# EAGLE design fanController (EAGLE 7.0.0)
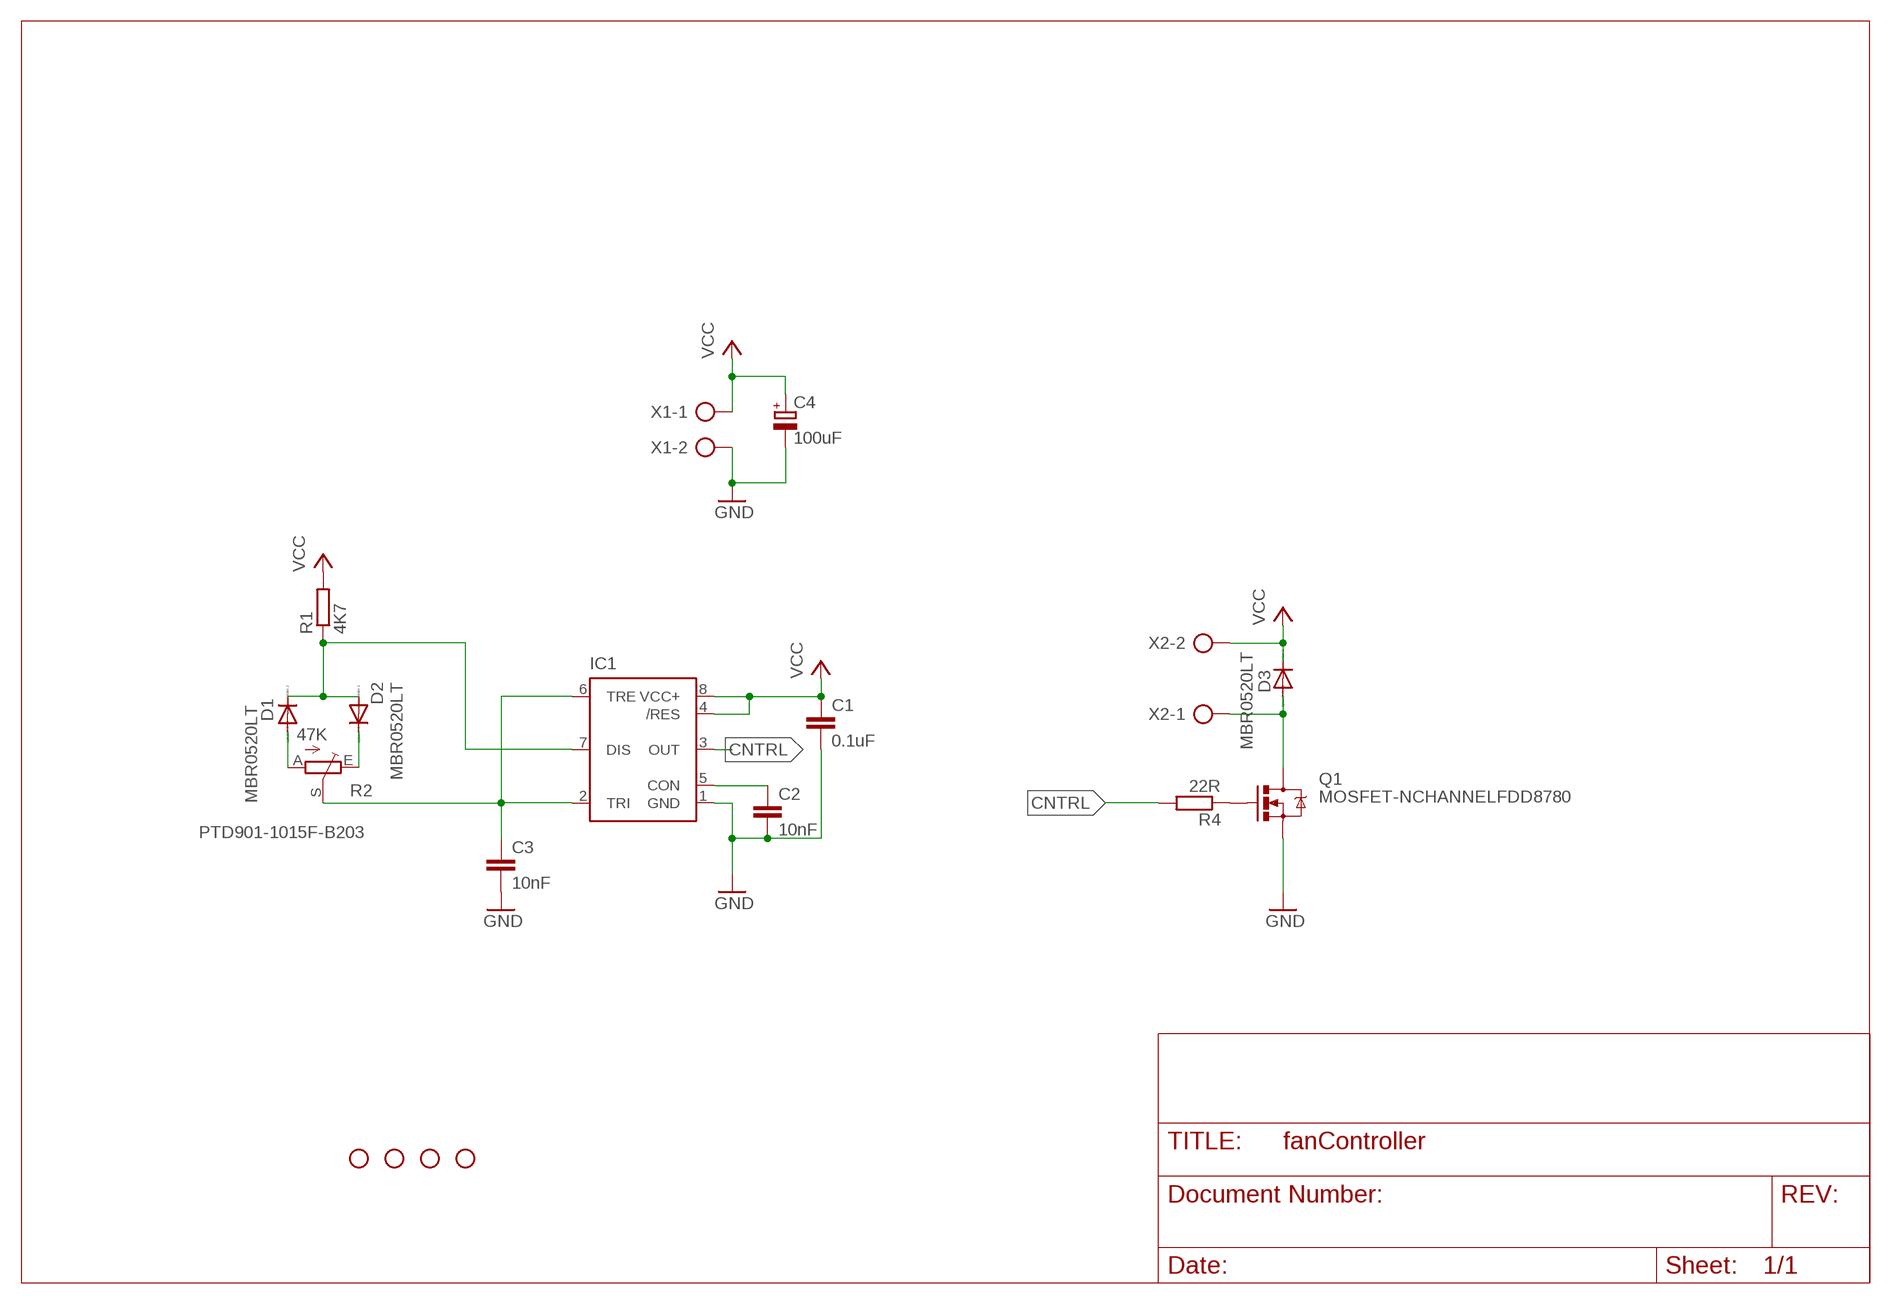
[diagram p0: schematic, sheet 1]

## Parts
C1  0.1uF  C-EUC0805  [C0805]
C2  10nF  C-EUC0805  [C0805]
C3  10nF  C-EUC0805  [C0805]
C4  100uF  CPOL-EUD  [PANASONIC_D]
D1  MBR0520LT  [SOD123]
D2  MBR0520LT  [SOD123]
D3  MBR0520LT  [SOD123]
IC1  NE555D  [SO08]
Q1  MOSFET-NCHANNELFDD8780  [DPAK]
R1  4K7  R-EU_M0805  [M0805]
R2  47K  TRIM_EU-B64Y  [B64Y]
R4  22R  R-EU_M0805  [M0805]
STANDOFF1  STAND-OFFTIGHT  [STAND-OFF-TIGHT]
STANDOFF2  STAND-OFFTIGHT  [STAND-OFF-TIGHT]
STANDOFF3  STAND-OFFTIGHT  [STAND-OFF-TIGHT]
STANDOFF4  STAND-OFFTIGHT  [STAND-OFF-TIGHT]
X1  AK500/2  [AK500/2]
X2  AK500/2  [AK500/2]

## Nets
CNTRL: IC1.3(OUT) R4.2
GND: C1.2 C2.2 C3.2 C4.- IC1.1(GND) Q1.3(S) X1.2
N$1: C2.1 IC1.5(CON)
N$2: D1.A R2.A
N$3: Q1.1(G) R4.1
N$4: C3.1 IC1.2(TRI) IC1.6(TRE) R2.S
N$5: D1.C D2.A IC1.7(DIS) R1.1
N$6: D2.C R2.E
N$8 [VCC]: D3.A Q1.4(D) X2.1
VCC [VCC]: C1.1 C4.+ D3.C IC1.4(/RES) IC1.8(VCC+) R1.2 X1.1 X2.2

## Notes on the sheet
- PTD901-1015F-B203

## Library data of the parts
C1-C3 = resistor:C-EU: CAPACITOR, European symbol
C4 = rcl:CPOL-EU: POLARIZED CAPACITOR, European symbol
D1-D3 = diode:MBR0520LT: SCHOTTKY BARRIER RECTIFIER Source: http://onsemi.com .. MBR0520LT1-D.pdf
IC1 = SparkFun-AnalogIC:NE555: General purpose bipolar Timer
Q1 = SparkFun-DiscreteSemi:MOSFET-NCHANNEL: Common NMOSFET Parts MFG P/N Store ID Prod ID FDD8780 TRANS-09984 SI7820DN TRANS-11055 FDS6630A IC-08089 2N7002PW TRANS-11151 FQP30N06L COM-10213 TRANS-10060 BSS123LT1G TRANS-08345 BSS138 TRANS-00830 BS170 2N7000; PROD_ID: TRANS-09984
R1 R4 = resistor:R-EU_: RESISTOR, European symbol
R2 = pot:TRIM_EU-: POTENTIOMETER
STANDOFF1-STANDOFF4 = SparkFun-Electromechanical:STAND-OFF: #4 Stand Off This is the mechanical footprint for a #4 phillips button head screw. Use the keepout ring to avoid running the screw head into surrounding components. SKU : PRT-00447
X1 X2 = con-ptr500:AK500/2: CONNECTOR; OC_FARNELL: unknown; OC_NEWARK: unknown

## Net classes
1 VCC: clearance 0.305 mm

## Board
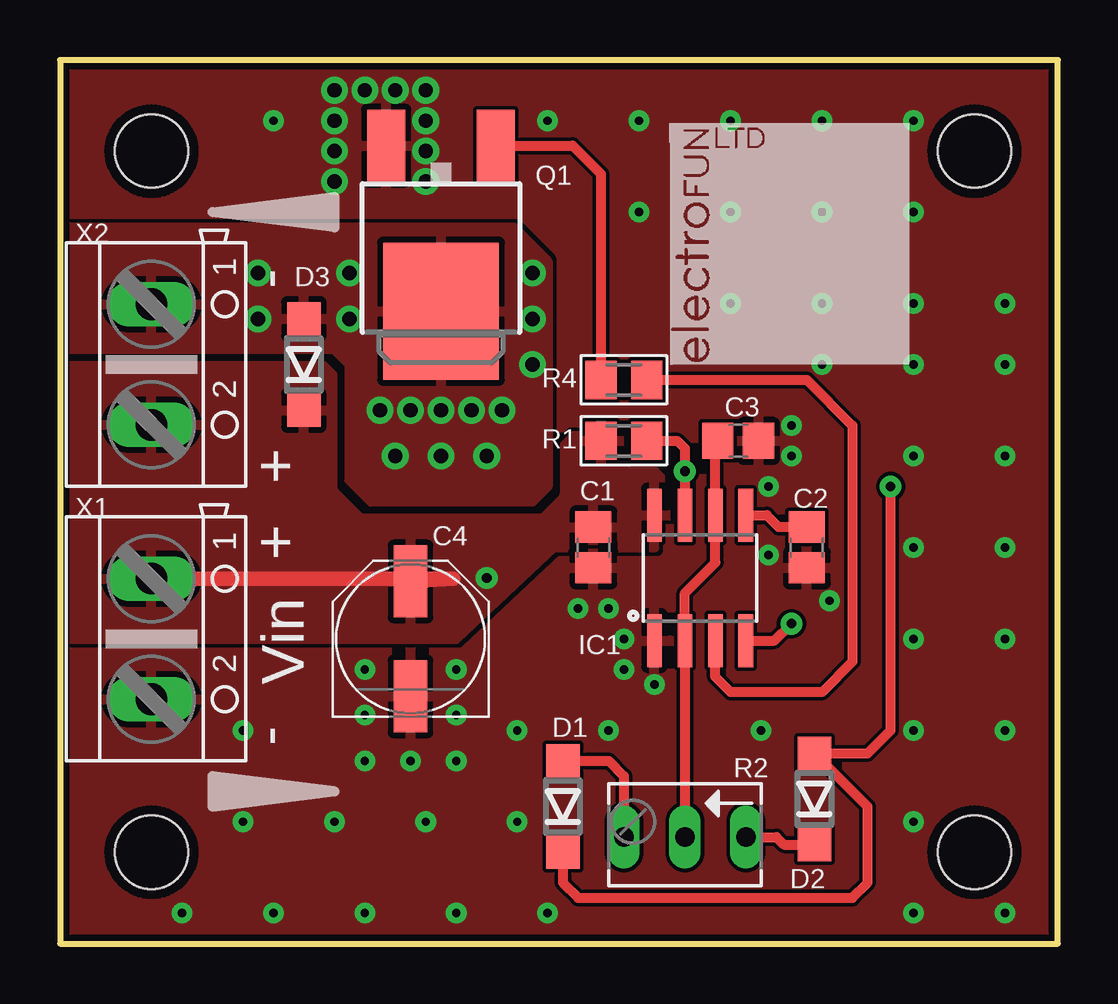
[diagram p1: board, top side]
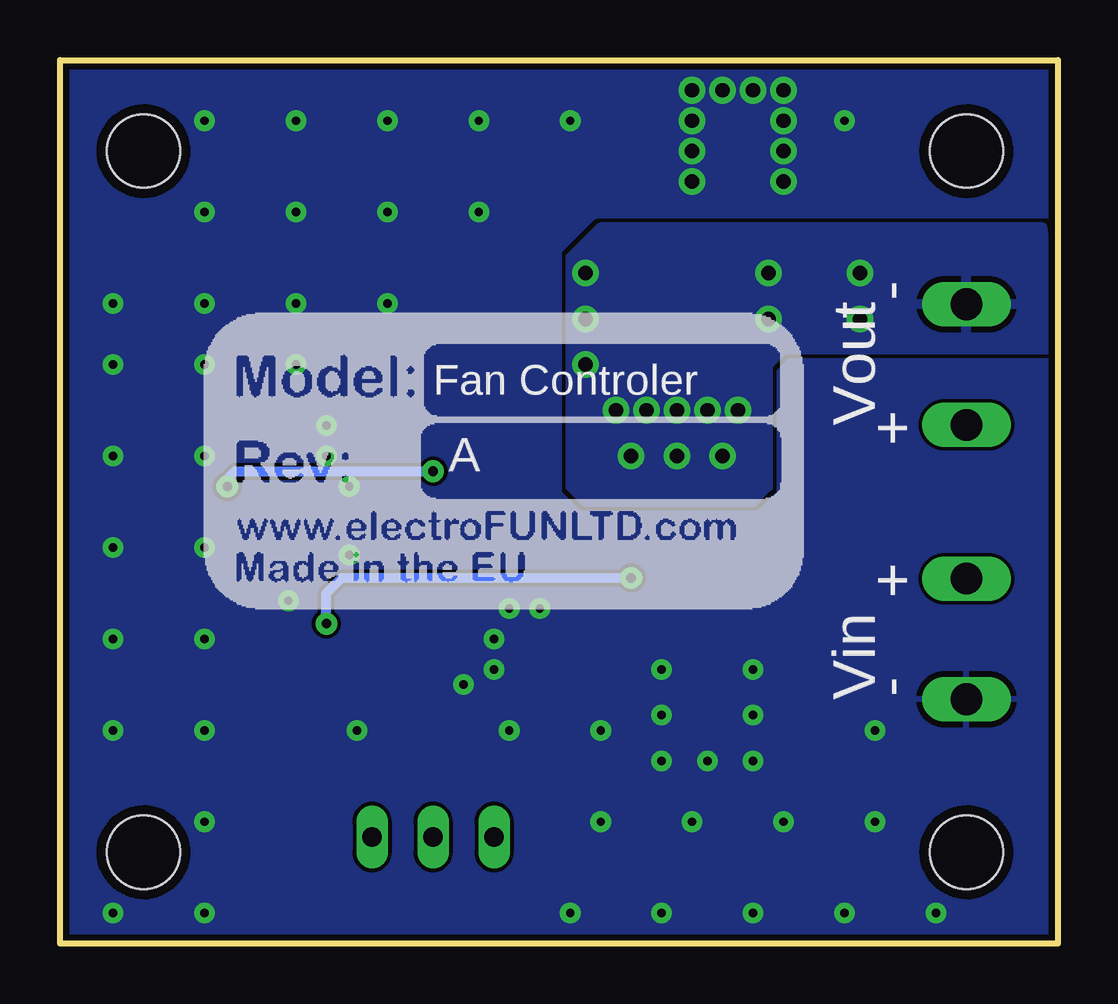
[diagram p2: board, bottom side, seen from below]

Size 41.58 x 36.82 mm. Coordinates in mm from the lower left corner, seen from the top.
Outline: 0,0 41.58,0 41.58,36.82 0,36.82 0,0
Copper layers (1*16): Top 0.035mm / dielectric 1.5mm / Bottom 0.035mm
Design rules "myDesignRules_tight": minimum track width 6mil, minimum drill 0.3mm, track to track 6mil, track to pad 6mil, pad to pad 6mil, via to via 6mil, smd to smd 6mil, copper to edge 10mil, drill to drill 8mil, minimum pad ring 10mil, minimum via ring 10mil, stop-mask expansion 4mil, vias tented up to drill 25mil, thermal gap 10mil

### Footprints (pad centres in the part's own frame; a part is rotated, then mirrored left to right if it is on the bottom)
C0805 = smd 1.3 x 1.5: 1 -0.85,0; 2 0.85,0
PANASONIC_D = smd 3 x 1.4: + 2.4,0; - -2.4,0
SOD123 = smd 1.4 x 1.4: A 1.9,0; C -1.9,0
SO08 = smd 0.61 x 2.21: 1 -1.905,-2.616; 2 -0.635,-2.616; 3 0.635,-2.616; 4 1.905,-2.616; 5 1.905,2.616; 6 0.635,2.616; 7 -0.635,2.616; 8 -1.905,2.616
DPAK = smd 1.6 x 3: 1 -2.28,-5.31; 3 2.28,-5.31 | smd 4.826 x 5.715: 4 0,1.588
M0805 = smd 1.3 x 1.6: 1 -0.95,0; 2 0.95,0
B64Y = drill 0.813 long: A 2.54,0; E -2.54,0; S 0,0
STAND-OFF-TIGHT = hole 3.048: 0,0
AK500/2 = drill 1.321 long: 1 -2.515,0; 2 2.515,0

### Placement (x,y rotation side)
C1  22.23,16.51 270 top
C2  31.11,16.51 270 top
C3  28.26,20.95 0 top
C4  14.61,12.7 90 top
D1  20.95,5.71 90 top
D2  31.43,6.03 90 top
D3  10.16,24.13 90 top
IC1  26.67,15.24 0 top
Q1  15.88,27.94 180 top
R1  23.5,20.95 180 top
R2  26.04,4.45 180 top
R4  23.5,23.5 0 top
STANDOFF1  3.81,3.81 0 top
STANDOFF2  3.81,33.02 0 top
STANDOFF3  38.1,3.81 0 top
STANDOFF4  38.1,33.02 0 top
U$1  [BOARD_REF]  35.56,13.97 0 bottom
U$2  [ELECTROFUN_10X10]  25.4,24.13 0 top
X1  3.81,12.7 270 top
X2  3.81,24.13 270 top

### Tracks (layer width: path | path; a pad name or v marks a point on that pad's centre or on a via)
CNTRL
  Top 0.406: R4.2 31.11,23.5 33.02,21.59 33.02,11.75 31.75,10.48 27.94,10.48 27.3,11.11 IC1.3
GND  (via drill 0.35, 0.6)
  other vias: 32.07,14.29 29.53,19.05 30.48,21.59 30.48,20.32 21.59,13.97 22.86,13.97 23.5,12.7 23.5,11.43 24.77,10.79 11.43,35.56 11.43,34.29 11.43,33.02 12.7,35.56 13.97,35.56 15.24,35.56 15.24,34.29 15.24,33.02 15.24,31.75 11.43,31.75 12.7,7.62 12.7,9.53 14.61,7.62 16.51,7.62 16.51,9.53 16.51,11.43 12.7,11.43 24.13,34.29 27.94,34.29 31.75,34.29 35.56,34.29 35.56,30.48 31.75,30.48 27.94,30.48 24.13,30.48 8.89,34.29 39.37,26.67 35.56,26.67 31.75,26.67 27.94,26.67 31.75,24.13 35.56,24.13 39.37,24.13 39.37,20.32 39.37,16.51 39.37,12.7 39.37,8.89 29.21,8.89 19.05,5.08 15.24,5.08 11.43,5.08 7.62,5.08 8.89,1.27 12.7,1.27 16.51,1.27 20.32,1.27 35.56,1.27 39.37,1.27 20.32,34.29 19.05,8.89 22.86,8.89 35.56,20.32 35.56,16.51 35.56,12.7 35.56,8.89 35.56,5.08 5.08,1.27 7.62,8.89 29.53,16.19
  pour Top (rank 3): 0,36.83 43.18,36.83 43.18,0 0,0
  pour Bottom (rank 2): 0,36.83 43.18,36.83 43.18,0 0,0
N$1
  Top 0.406: IC1.5 29.45,17.86 29.95,17.36 C2.1
N$2
  Top 0.406: D1.A 22.86,7.62 23.5,6.99 R2.A
N$3
  Top 0.406: R4.1 22.55,32.06 21.36,33.25 Q1.1
N$4
  Top 0.406: C3.1 27.3,20.74 IC1.6 27.3,15.88 26.04,14.61 IC1.2 R2.S
N$5  (via drill 0.4)
  Top 0.406: IC1.7 v26.04,19.68 26.04,20.64 25.72,20.95 R1.1 | v34.61,19.05 34.61,8.89 33.65,7.93 D2.A 33.66,5.71 33.66,2.54 33.02,1.91 21.59,1.91 20.95,2.54 D1.C
  Bottom 0.406: v34.61,19.05 34.61,19.37 34.29,19.68 v26.04,19.68
N$6
  Top 0.406: R2.E 29.84,4.45 30.16,4.13 D2.C
N$8  (via drill 0.6)
  other vias: 8.26,27.94 12.06,27.94 13.34,22.23 14.61,22.23 15.88,22.23 17.14,22.23 18.41,22.23 19.68,26.04 17.78,20.32 15.88,20.32 13.97,20.32 12.06,26.04 19.68,27.94 19.68,24.13 8.26,26.04
  pour Top: 0,29.84 18.9,29.84 20.32,28.43 20.32,19.05 19.68,18.41 12.96,18.41 12.06,19.31 12.06,24.13 11.43,24.77 0,24.77
  pour Bottom: 0.64,29.84 19.05,29.84 20.32,28.57 20.32,19.05 19.68,18.41 12.7,18.41 12.06,19.05 12.06,24.13 11.43,24.77 0,24.77
VCC  (via drill 0.4)
  Top 0.406: IC1.4 29.77,12.62 v30.48,13.34
  Top 0.61: X1.1 16.39,15.21 C4.+
  Bottom 0.406: v30.48,13.34 30.48,14.61 29.84,15.24 v17.78,15.24
  pour Top (rank 2): 0,24.13 0,12.7 16.51,12.7 20.58,16.51 24.77,16.51 25.4,17.14 25.4,19.05 24.77,19.68 24.13,19.68 23.5,20.32 23.5,21.59 21.85,21.59 20.95,20.69 20.95,19.05 19.68,17.78 12.7,17.78 11.43,19.05 11.43,24.13

### Text on the board
tPlace: - | + | + | Vin | -
bPlace: - | Fan Controler | Vout | + | A | + | - | Vin